# Altium schematic sheet CellSelectModule.SchDoc
size A4; SheetNumber: 2; SheetTotal: 2
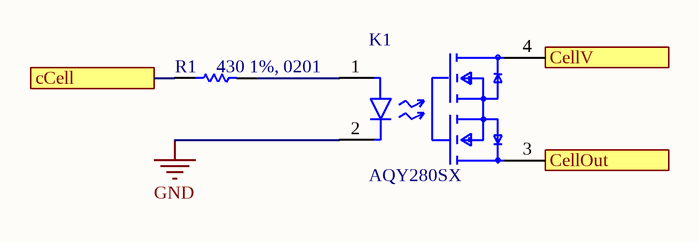
[diagram p0: CellSelectModule.SchDoc]

## Parts
K1  AQY280SX  [FP-AQY280SX-MFG]
R1  430 1%, 0201  [RESC0603X26X15NL03T05]

## Ports
cCell (see CellVoltageControl[2C]), CellOut (see CellVoltageControl[2C]), CellV (see CellVoltageControl[2C])

## Nets
GND: K1.2(C)
cCell: R1.1 ; port cCell
CellOut: K1.3(1_DRAIN) ; port CellOut
CellV: K1.4(2_DRAIN) ; port CellV
NetK1_1: K1.1(A) R1.2

## Library data of the parts
K1 = CMP-00287-00695349-1: AQY280SX AQY Photomos Series 120 mA 350 V 25 Ohm SMT 1 Channel Solid State Relay -SOP-4; NexarPartId: 695349; Output Current: 120mA; Throw Configuration: DPST, SPST; Resistance: 25Ω; Max Input Current: 50mA; Max Output Voltage: 350V; Isolation Voltage: 1.5kV; Termination: Gull Wing; Number of Pins: 4; Max Output Current: 120mA; RoHS: Compliant; Mount: Surface Mount; Radiation Hardening: No; Max Operating Temperature: 85°C; Height: 2.1mm; Case/Package: SOP; Forward Current: 50mA; Input Current: 50mA; Lead Free: Lead Free; Length: 4.4mm; Width: 4.3mm; Min Operating Temperature: -40°C; Output Voltage: 350V; Relay Type: Relay; Load Current: 120mA
R1 = CMP-2004-03546-1: Manufacturer: Panasonic; Part Number: ERJ1GNF4302C